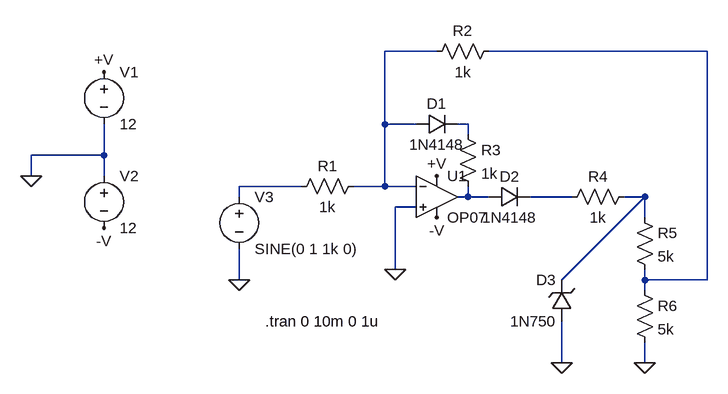
[diagram p0: schematic tl.asc]
tl.asc, the LTspice schematic file:
Version 4
SHEET 1 880 680
WIRE 352 -64 272 -64
WIRE 768 -64 432 -64
WIRE 272 48 272 -64
WIRE 320 48 272 48
WIRE 400 48 384 48
WIRE 400 64 400 48
WIRE -160 96 -160 48
WIRE -160 96 -272 96
WIRE -272 128 -272 96
WIRE -160 128 -160 96
WIRE 144 144 48 144
WIRE 272 144 272 48
WIRE 272 144 224 144
WIRE 320 144 272 144
WIRE 48 160 48 144
WIRE 400 160 400 144
WIRE 400 160 384 160
WIRE 432 160 400 160
WIRE 560 160 496 160
WIRE 672 160 640 160
WIRE 320 176 288 176
WIRE 672 192 672 160
WIRE 288 272 288 176
WIRE 48 288 48 240
WIRE 544 288 672 160
WIRE 672 288 672 272
WIRE 768 288 768 -64
WIRE 768 288 672 288
WIRE 672 304 672 288
WIRE 544 416 544 352
WIRE 672 416 672 384
FLAG -272 128 0
FLAG -160 -32 +V
FLAG -160 208 -V
FLAG 352 192 -V
FLAG 352 128 +V
FLAG 288 272 0
FLAG 48 288 0
FLAG 672 416 0
FLAG 544 416 0
SYMBOL voltage -160 -48 R0
WINDOW 123 0 0 Left 2
WINDOW 39 0 0 Left 2
SYMATTR InstName V1
SYMATTR Value 12
SYMBOL voltage -160 112 R0
WINDOW 123 0 0 Left 2
WINDOW 39 0 0 Left 2
SYMATTR InstName V2
SYMATTR Value 12
SYMBOL Opamps\\OP07 352 96 R0
SYMATTR InstName U1
SYMBOL voltage 48 144 R0
WINDOW 123 0 0 Left 2
WINDOW 39 0 0 Left 2
SYMATTR InstName V3
SYMATTR Value SINE(0 1 1k 0)
SYMBOL res 240 128 R90
WINDOW 0 0 56 VBottom 2
WINDOW 3 32 56 VTop 2
SYMATTR InstName R1
SYMATTR Value 1k
SYMBOL res 448 -80 R90
WINDOW 0 0 56 VBottom 2
WINDOW 3 32 56 VTop 2
SYMATTR InstName R2
SYMATTR Value 1k
SYMBOL diode 320 64 R270
WINDOW 0 32 32 VTop 2
WINDOW 3 0 32 VBottom 2
SYMATTR InstName D1
SYMATTR Value 1N4148
SYMBOL diode 432 176 R270
WINDOW 0 32 32 VTop 2
WINDOW 3 0 32 VBottom 2
SYMATTR InstName D2
SYMATTR Value 1N4148
SYMBOL res 384 48 R0
SYMATTR InstName R3
SYMATTR Value 1k
SYMBOL res 656 144 R90
WINDOW 0 0 56 VBottom 2
WINDOW 3 32 56 VTop 2
SYMATTR InstName R4
SYMATTR Value 1k
SYMBOL res 656 176 R0
SYMATTR InstName R5
SYMATTR Value 5k
SYMBOL res 656 288 R0
SYMATTR InstName R6
SYMATTR Value 5k
SYMBOL zener 560 352 R180
WINDOW 0 24 64 Left 2
WINDOW 3 24 0 Left 2
SYMATTR InstName D3
SYMATTR Value 1N750
SYMATTR Description Diode
SYMATTR Type diode
TEXT 88 352 Left 2 !.tran 0 10m 0 1u

The netlist it stands for:
* tl.asc
V1 +V 0 12
V2 0 -V 12
XU1 0 N001 +V -V N005 LT1001  ; OP07, pins In+ In- V+ V- OUT
V3 N004 0 SINE(0 1 1k 0)
R1 N001 N004 1k
R2 N002 N001 1k
D1 N001 N003 1N4148
D2 N005 N006 1N4148
R3 N003 N005 1k
R4 N007 N006 1k
R5 N007 N002 5k
R6 N002 0 5k
D3 0 N007 1N750
.model D D
.lib standard.dio
.tran 0 10m 0 1u
.lib LTC.lib
.backanno
.end